# Altium schematic sheet fpga ram V1.SchDoc
size A3; Organization: Blinkinlabs, LLC
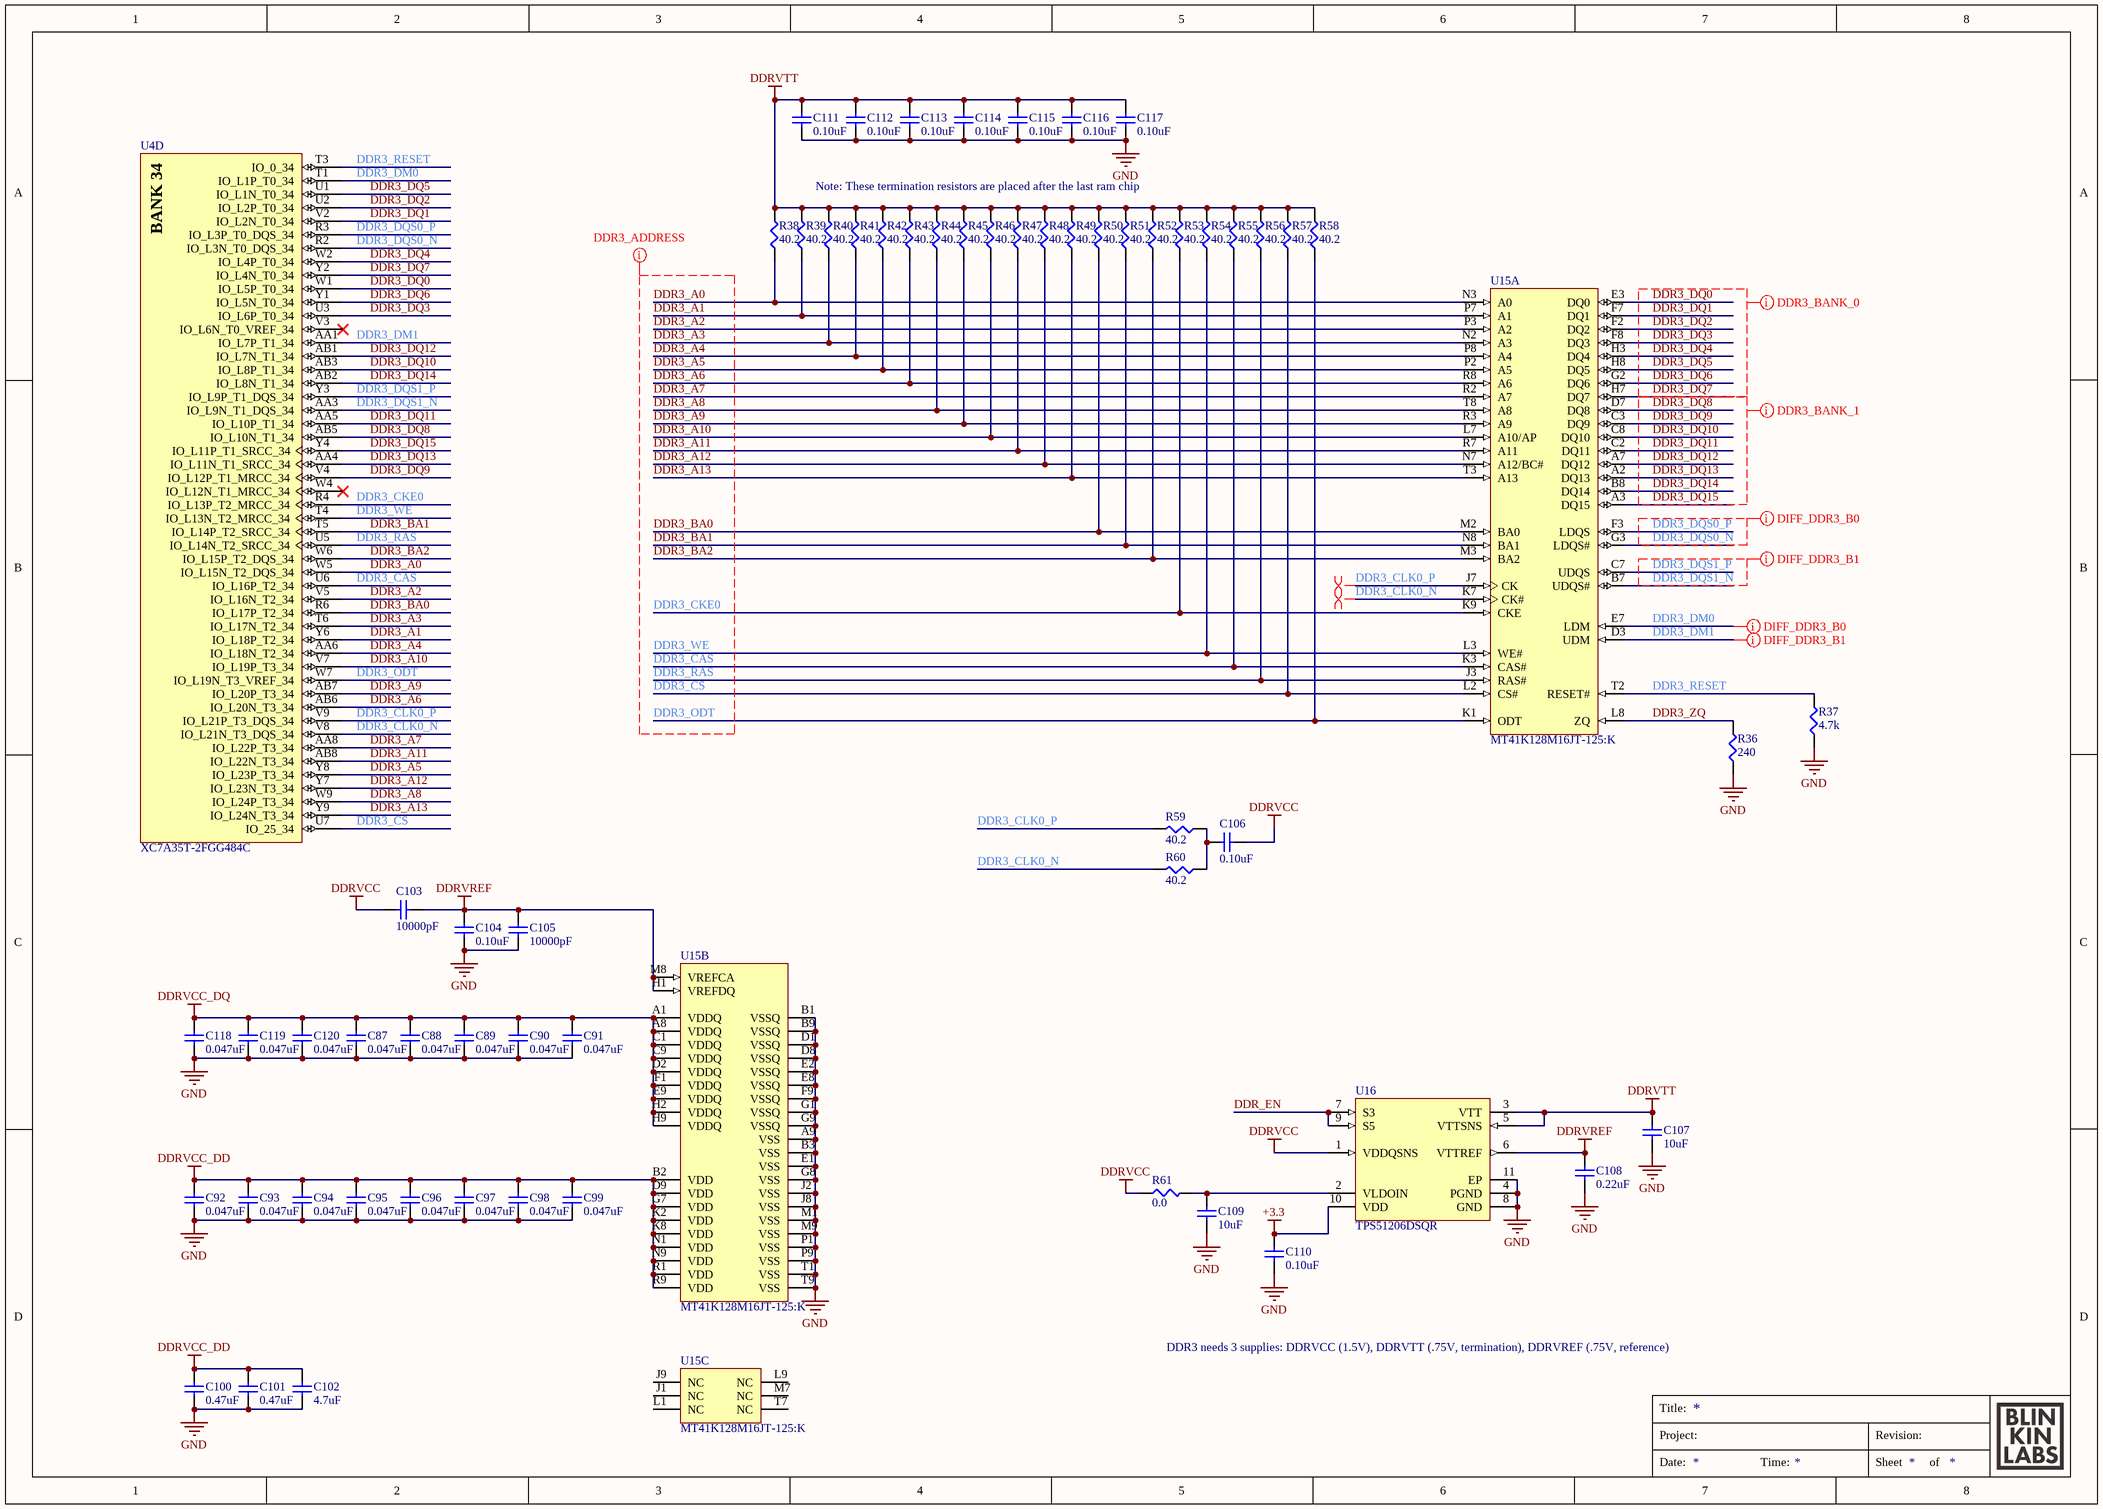
[diagram p0: fpga ram V1.SchDoc]

## Parts
C87  0.047uF  [CAPC1005X06L]
C88  0.047uF  [CAPC1005X06L]
C89  0.047uF  [CAPC1005X06L]
C90  0.047uF  [CAPC1005X06L]
C91  0.047uF  [CAPC1005X06L]
C92  0.047uF  [CAPC1005X06L]
C93  0.047uF  [CAPC1005X06L]
C94  0.047uF  [CAPC1005X06L]
C95  0.047uF  [CAPC1005X06L]
C96  0.047uF  [CAPC1005X06L]
C97  0.047uF  [CAPC1005X06L]
C98  0.047uF  [CAPC1005X06L]
C99  0.047uF  [CAPC1005X06L]
C100  0.47uF  [CAPC1005X06L]
C101  0.47uF  [CAPC1005X06L]
C102  4.7uF  [CAPC1005X06L]
C103  10000pF  [CAPC1005X06L]
C104  0.10uF  [CAPC1005X06L]
C105  10000pF  [CAPC1005X06L]
C106  0.10uF  [CAPC1005X06L]
C107  10uF  [CAPC1608X09L]
C108  0.22uF  [CAPC1005X06L]
C109  10uF  [CAPC1608X09L]
C110  0.10uF  [CAPC1005X06L]
C111  0.10uF  [CAPC1005X06L]
C112  0.10uF  [CAPC1005X06L]
C113  0.10uF  [CAPC1005X06L]
C114  0.10uF  [CAPC1005X06L]
C115  0.10uF  [CAPC1005X06L]
C116  0.10uF  [CAPC1005X06L]
C117  0.10uF  [CAPC1005X06L]
C118  0.047uF  [CAPC1005X06L]
C119  0.047uF  [CAPC1005X06L]
C120  0.047uF  [CAPC1005X06L]
R36  240  [ERJ2G(0402)_L]
R37  4.7k  [ERJ2G(0402)_L]
R38  40.2  [ERJ2G(0402)_L]
R39  40.2  [ERJ2G(0402)_L]
R40  40.2  [ERJ2G(0402)_L]
R41  40.2  [ERJ2G(0402)_L]
R42  40.2  [ERJ2G(0402)_L]
R43  40.2  [ERJ2G(0402)_L]
R44  40.2  [ERJ2G(0402)_L]
R45  40.2  [ERJ2G(0402)_L]
R46  40.2  [ERJ2G(0402)_L]
R47  40.2  [ERJ2G(0402)_L]
R48  40.2  [ERJ2G(0402)_L]
R49  40.2  [ERJ2G(0402)_L]
R50  40.2  [ERJ2G(0402)_L]
R51  40.2  [ERJ2G(0402)_L]
R52  40.2  [ERJ2G(0402)_L]
R53  40.2  [ERJ2G(0402)_L]
R54  40.2  [ERJ2G(0402)_L]
R55  40.2  [ERJ2G(0402)_L]
R56  40.2  [ERJ2G(0402)_L]
R57  40.2  [ERJ2G(0402)_L]
R58  40.2  [ERJ2G(0402)_L]
R59  40.2  [ERJ2G(0402)_L]
R60  40.2  [ERJ2G(0402)_L]
R61  0.0  [ERJ3G(0603)_L]
U4  XC7A35T-2FGG484C  [FGG484]  (part D of 12)
U15  MT41K128M16JT-125:K  [MICT-JT-96]  (parts A,B,C of 3)
U16  TPS51206DSQR  [DSQ0010A_V]

## Nets
+3.3: C110.1 U16.10(VDD)
DDRVCC: C103.1 C106.1 R61.1 U16.1(VDDQSNS)
DDRVCC_DD: C92.1 C93.1 C94.1 C95.1 C96.1 C97.1 C98.1 C99.1 C100.1 C101.1 C102.2 U15.B2(VDD) U15.D9(VDD) U15.G7(VDD) U15.K2(VDD) U15.K8(VDD) U15.N1(VDD) U15.N9(VDD) U15.R1(VDD) U15.R9(VDD)
DDRVCC_DQ: C87.1 C88.1 C89.1 C90.1 C91.1 C118.1 C119.1 C120.1 U15.A1(VDDQ) U15.A8(VDDQ) U15.C1(VDDQ) U15.C9(VDDQ) U15.D2(VDDQ) U15.E9(VDDQ) U15.F1(VDDQ) U15.H2(VDDQ) U15.H9(VDDQ)
DDRVREF: C103.2 C104.2 C105.1 C108.1 U15.H1(VREFDQ) U15.M8(VREFCA) U16.6(VTTREF)
DDRVTT: C107.1 C111.2 C112.2 C113.2 C114.2 C115.2 C116.2 C117.2 R38.2 R39.2 R40.2 R41.2 R42.2 R43.2 R44.2 R45.2 R46.2 R47.2 R48.2 R49.2 R50.2 R51.2 R52.2 R53.2 R54.2 R55.2 R56.2 R57.2 R58.2 U16.3(VTT) U16.5(VTTSNS)
GND: C87.2 C88.2 C89.2 C90.2 C91.2 C92.2 C93.2 C94.2 C95.2 C96.2 C97.2 C98.2 C99.2 C100.2 C101.2 C102.1 C104.1 C105.2 C107.2 C108.2 C109.2 C110.2 C111.1 C112.1 C113.1 C114.1 C115.1 C116.1 C117.1 C118.2 C119.2 C120.2 R36.1 R37.1 U15.A9(VSS) U15.B1(VSSQ) U15.B3(VSS) U15.B9(VSSQ) U15.D1(VSSQ) U15.D8(VSSQ) U15.E1(VSS) U15.E2(VSSQ) U15.E8(VSSQ) U15.F9(VSSQ) U15.G1(VSSQ) U15.G8(VSS) U15.G9(VSSQ) U15.J2(VSS) U15.J8(VSS) U15.M1(VSS) U15.M9(VSS) U15.P1(VSS) U15.P9(VSS) U15.T1(VSS) U15.T9(VSS) U16.4(PGND) U16.8(GND) U16.11(EP)
DDR3_A0: R38.1 U4.W5(IO_L15N_T2_DQS_34) U15.N3(A0)
DDR3_A1: R39.1 U4.Y6(IO_L18P_T2_34) U15.P7(A1)
DDR3_A2: U4.V5(IO_L16N_T2_34) U15.P3(A2)
DDR3_A3: R40.1 U4.T6(IO_L17N_T2_34) U15.N2(A3)
DDR3_A4: R41.1 U4.AA6(IO_L18N_T2_34) U15.P8(A4)
DDR3_A5: R42.1 U4.Y8(IO_L23P_T3_34) U15.P2(A5)
DDR3_A6: R43.1 U4.AB6(IO_L20N_T3_34) U15.R8(A6)
DDR3_A7: U4.AA8(IO_L22P_T3_34) U15.R2(A7)
DDR3_A8: R44.1 U4.W9(IO_L24P_T3_34) U15.T8(A8)
DDR3_A9: R45.1 U4.AB7(IO_L20P_T3_34) U15.R3(A9)
DDR3_A10: R46.1 U4.V7(IO_L19P_T3_34) U15.L7(A10/AP)
DDR3_A11: R47.1 U4.AB8(IO_L22N_T3_34) U15.R7(A11)
DDR3_A12: R48.1 U4.Y7(IO_L23N_T3_34) U15.N7(A12/BC#)
DDR3_A13: R49.1 U4.Y9(IO_L24N_T3_34) U15.T3(A13)
DDR3_BA0: R50.1 U4.R6(IO_L17P_T2_34) U15.M2(BA0)
DDR3_BA1: R51.1 U4.T5(IO_L14P_T2_SRCC_34) U15.N8(BA1)
DDR3_BA2: R52.1 U4.W6(IO_L15P_T2_DQS_34) U15.M3(BA2)
DDR3_CAS: R55.1 U4.U6(IO_L16P_T2_34) U15.K3(CAS#)
DDR3_CKE0: R53.1 U4.R4(IO_L13P_T2_MRCC_34) U15.K9(CKE)
DDR3_CLK0_N: R60.2 U4.V8(IO_L21N_T3_DQS_34) U15.K7(CK#)
DDR3_CLK0_P: R59.2 U4.V9(IO_L21P_T3_DQS_34) U15.J7(CK)
DDR3_CS: R57.1 U4.U7(IO_25_34) U15.L2(CS#)
DDR3_DM0: U4.T1(IO_L1P_T0_34) U15.E7(LDM)
DDR3_DM1: U4.AA1(IO_L7P_T1_34) U15.D3(UDM)
DDR3_DQ0: U4.W1(IO_L5P_T0_34) U15.E3(DQ0)
DDR3_DQ1: U4.V2(IO_L2N_T0_34) U15.F7(DQ1)
DDR3_DQ2: U4.U2(IO_L2P_T0_34) U15.F2(DQ2)
DDR3_DQ3: U4.U3(IO_L6P_T0_34) U15.F8(DQ3)
DDR3_DQ4: U4.W2(IO_L4P_T0_34) U15.H3(DQ4)
DDR3_DQ5: U4.U1(IO_L1N_T0_34) U15.H8(DQ5)
DDR3_DQ6: U4.Y1(IO_L5N_T0_34) U15.G2(DQ6)
DDR3_DQ7: U4.Y2(IO_L4N_T0_34) U15.H7(DQ7)
DDR3_DQ8: U4.AB5(IO_L10N_T1_34) U15.D7(DQ8)
DDR3_DQ9: U4.V4(IO_L12P_T1_MRCC_34) U15.C3(DQ9)
DDR3_DQ10: U4.AB3(IO_L8P_T1_34) U15.C8(DQ10)
DDR3_DQ11: U4.AA5(IO_L10P_T1_34) U15.C2(DQ11)
DDR3_DQ12: U4.AB1(IO_L7N_T1_34) U15.A7(DQ12)
DDR3_DQ13: U4.AA4(IO_L11N_T1_SRCC_34) U15.A2(DQ13)
DDR3_DQ14: U4.AB2(IO_L8N_T1_34) U15.B8(DQ14)
DDR3_DQ15: U4.Y4(IO_L11P_T1_SRCC_34) U15.A3(DQ15)
DDR3_DQS0_N: U4.R2(IO_L3N_T0_DQS_34) U15.G3(LDQS#)
DDR3_DQS0_P: U4.R3(IO_L3P_T0_DQS_34) U15.F3(LDQS)
DDR3_DQS1_N: U4.AA3(IO_L9N_T1_DQS_34) U15.B7(UDQS#)
DDR3_DQS1_P: U4.Y3(IO_L9P_T1_DQS_34) U15.C7(UDQS)
DDR3_ODT: R58.1 U4.W7(IO_L19N_T3_VREF_34) U15.K1(ODT)
DDR3_RAS: R56.1 U4.U5(IO_L14N_T2_SRCC_34) U15.J3(RAS#)
DDR3_RESET: R37.2 U4.T3(IO_0_34) U15.T2(RESET#)
DDR3_WE: R54.1 U4.T4(IO_L13N_T2_MRCC_34) U15.L3(WE#)
DDR3_ZQ: R36.2 U15.L8(ZQ)
DDR_EN: U16.7(S3) U16.9(S5)
NetC106_2: C106.2 R59.1 R60.1
NetC109_1: C109.1 R61.2 U16.2(VLDOIN)

Not connected (* = marked no-connect by the designer): U4 V3(IO_L6N_T0_VREF_34)* W4(IO_L12N_T1_MRCC_34)*; U15 J1(NC) J9(NC) L1(NC) L9(NC) M7(NC) T7(NC)

## Layout directives
net class DDR3_ADDRESS; net class DDR3_SE: DDR3_A0, DDR3_A1, DDR3_A2, DDR3_A3, DDR3_A4, DDR3_A5, DDR3_A6, DDR3_A7, DDR3_A8, DDR3_A9, DDR3_A10, DDR3_A11, DDR3_A12, DDR3_A13, DDR3_BA0, DDR3_BA1, DDR3_BA2, DDR3_CAS, DDR3_CKE0, DDR3_CS, DDR3_ODT, DDR3_RAS, DDR3_WE
net class DDR3_B0; rule Matched Net Lengths [Delay Tolerance = 15ps]; rule Impedance Constraint [Min = 50.00    Max = 50.00    ]; net class DDR3_SE: DDR3_DQ0, DDR3_DQ1, DDR3_DQ2, DDR3_DQ3, DDR3_DQ4, DDR3_DQ5, DDR3_DQ6, DDR3_DQ7
differential pair: DDR3_CLK0_N, DDR3_CLK0_P
net class DDR3_B1; rule Matched Net Lengths [Delay Tolerance = 15ps]; rule Impedance Constraint [Min = 50.00    Max = 50.00    ]; net class DDR3_SE: DDR3_DQ7, DDR3_DQ8, DDR3_DQ9, DDR3_DQ10, DDR3_DQ11, DDR3_DQ12, DDR3_DQ13, DDR3_DQ14, DDR3_DQ15
differential pair; differential pair class DIFF_90Ohm_PCIE; differential pair class DIFF_DDR3_B0; net class DDR3; rule Matched Net Lengths [Tolerance = 0.1mm]: DDR3_DM0, DDR3_DQS0_N, DDR3_DQS0_P
differential pair; differential pair class DIFF_90Ohm_PCIE; differential pair class DIFF_DDR3_B1; net class DDR3; rule Matched Net Lengths [Tolerance = 0.1mm]: DDR3_DM1, DDR3_DQS1_N, DDR3_DQS1_P

## Notes on the sheet
- Note: These termination resistors are placed after the last ram chip
- DDR3 needs 3 supplies: DDRVCC (1.5V), DDRVTT (.75V, termination), DDRVREF (.75V, reference)
- Title:
- Project:
- Revision:
- Date:
- Time:
- Sheet
- of
- (in symbol CMP-0383-00019-1, part D) BANK 34

## Library data of the parts
C87-C99 C118-C120 = GRM155R60J473KA01D: CAP CER 0.047UF 6.3V X5R 0402; Manufacturer: Murata Electronics North America; Tolerance: ±10%; PartNumber: GRM155R60J473KA01D; Datasheets: http://www.murata.com/~/media/webrenewal/support/library/catalog/products/capacitor/mlcc/c02e.pdf; Image: //media.digikey.com/Renders/Murata%20Renders/ZRB-SERIES-0402.jpg; Digi-Key Part Number: 490-8250-1-ND; Packaging: Cut Tape (CT); Series: GRM; Value: 0.047uF; Voltage: 6.3V; Temperature Coefficient: X5R; Operating Temperature: -55°C ~ 85°C; Features: -; Applications: General Purpose; Package / Case: 0402 (1005 Metric); Case/Package: 0402
C100 C101 = GRM155R60J474KE19D: CAP CER 0.47UF 6.3V X5R 0402; Manufacturer: Murata Electronics North America; Tolerance: ±10%; PartNumber: GRM155R60J474KE19D; Datasheets: http://www.murata.com/~/media/webrenewal/support/library/catalog/products/capacitor/mlcc/c02e.pdf; Image: //media.digikey.com/Renders/Murata%20Renders/ZRB-SERIES-0402.jpg; Digi-Key Part Number: 490-3266-1-ND; Packaging: Cut Tape (CT); Series: GRM; Value: 0.47uF; Voltage: 6.3V; Temperature Coefficient: X5R; Operating Temperature: -55°C ~ 85°C; Features: -; Applications: General Purpose; Package / Case: 0402 (1005 Metric); Case/Package: 0402
C102 = GRM155R60G475ME47D: CAP CER 4.7UF 4V X5R 0402; Manufacturer: Murata Electronics North America; Tolerance: ±20%; PartNumber: GRM155R60G475ME47D; Datasheets: http://www.murata.com/~/media/webrenewal/support/library/catalog/products/capacitor/mlcc/c02e.pdf; Image: //media.digikey.com/Renders/Murata%20Renders/ZRB-SERIES-0402.jpg; Digi-Key Part Number: 490-11980-1-ND; Packaging: Cut Tape (CT); Series: GRM; Value: 4.7uF; Voltage: 4V; Temperature Coefficient: X5R; Operating Temperature: -55°C ~ 85°C; Features: -; Applications: General Purpose; Package / Case: 0402 (1005 Metric); Case/Package: 0402
C103 C105 = GRM155R71C103KA01D: CAP CER 10000PF 16V X7R 0402; Manufacturer: Murata Electronics North America; Tolerance: ±10%; PartNumber: GRM155R71C103KA01D; Datasheets: http://www.murata.com/~/media/webrenewal/support/library/catalog/products/capacitor/mlcc/c02e.pdf; Image: //media.digikey.com/Renders/Murata%20Renders/ZRB-SERIES-0402.jpg; Digi-Key Part Number: 490-1313-1-ND; Packaging: Cut Tape (CT); Series: GRM; Value: 10000pF; Voltage: 16V; Temperature Coefficient: X7R; Operating Temperature: -55°C ~ 125°C; Features: -; Applications: General Purpose; Package / Case: 0402 (1005 Metric); Case/Package: 0402
C104 C106 C110-C117 = GRM155R61A104KA01D: CAP CER 0.1UF 10V X5R 0402; Manufacturer: Murata Electronics North America; Tolerance: ±10%; PartNumber: GRM155R61A104KA01D; Datasheets: http://www.murata.com/~/media/webrenewal/support/library/catalog/products/capacitor/mlcc/c02e.pdf; Image: //media.digikey.com/Renders/Murata%20Renders/ZRB-SERIES-0402.jpg; Digi-Key Part Number: 490-1318-1-ND; Packaging: Cut Tape (CT); Series: GRM; Value: 0.10uF; Voltage: 10V; Temperature Coefficient: X5R; Operating Temperature: -55°C ~ 85°C; Features: -; Applications: General Purpose; Package / Case: 0402 (1005 Metric); Case/Package: 0402
C107 C109 = GRM188R60J106ME47D: CAP CER 10UF 6.3V X5R 0603; Manufacturer: Murata Electronics North America; Tolerance: ±20%; PartNumber: GRM188R60J106ME47D; Datasheets: http://www.murata.com/~/media/webrenewal/support/library/catalog/products/capacitor/mlcc/c02e.pdf; Image: //media.digikey.com/Renders/Murata%20Renders/ZRB-SERIES-0402.jpg; Digi-Key Part Number: 490-3896-1-ND; Series: GRM; Value: 10uF; Voltage: 6.3V; Temperature Coefficient: X5R; Operating Temperature: -55°C ~ 85°C; Features: -; Applications: General Purpose; Package / Case: 0603 (1608 Metric); Case/Package: 0603
C108 = GRM155R61A224KE19J: CAP CER 0.22UF 10V X5R 0402; Manufacturer: Murata Electronics North America; Tolerance: ±10%; PartNumber: GRM155R61A224KE19J; Datasheets: http://www.murata.com/~/media/webrenewal/support/library/catalog/products/capacitor/mlcc/c02e.pdf; Image: //media.digikey.com/Renders/Murata%20Renders/ZRB-SERIES-0402.jpg; Digi-Key Part Number: 490-6303-1-ND; Packaging: Cut Tape (CT); Series: GRM; Value: 0.22uF; Voltage: 10V; Temperature Coefficient: X5R; Operating Temperature: -55°C ~ 85°C; Features: -; Applications: General Purpose; Package / Case: 0402 (1005 Metric); Case/Package: 0402
R36 = ERJ-2RKF2400X: RES SMD 240 OHM 1% 1/10W 0402; Manufacturer: Panasonic Electronic Components; Power (Watts): 0.1W, 1/10W; Temperature Coefficient: ±100ppm/°C; PartNumber: ERJ-2RKF2400X; Datasheets: http://industrial.panasonic.com/www-cgi/jvcr13pz.cgi?E+PZ+3+AOA0002+ERJ2RKF2400X+7+WW; Image: //media.digikey.com/Photos/Panasonic%20Photos/ERJ-PA2-Series.jpg; Digi-Key Part Number: P240LCT-ND; Series: ERJ; Value: 240; Tolerance: ±1%; Composition: Thick Film; Features: Automotive AEC-Q200; Operating Temperature: -55°C ~ 155°C; Package / Case: 0402 (1005 Metric); Case/Package: 0402; Size / Dimension: 0.039" L x 0.020" W (1.00mm x 0.50mm); Height - Seated (Max): 0.016" (0.40mm); Number of Terminations: 2
R37 = ERJ-PA2F4701X: RES SMD 4.7K OHM 1% 1/5W 0402; Manufacturer: Panasonic Electronic Components; Power (Watts): 0.2W, 1/5W; Temperature Coefficient: ±100ppm/°C; PartNumber: ERJ-PA2F4701X; Datasheets: https://industrial.panasonic.com/cdbs/www-data/pdf/RDA0000/AOA0000C243.pdf; Image: //media.digikey.com/Photos/Panasonic%20Photos/ERJ-PA2-Series.jpg; Digi-Key Part Number: P17228CT-ND; Series: ERJ; Value: 4.7k; Tolerance: ±1%; Composition: Thick Film; Features: Automotive AEC-Q200, Pulse Withstanding; Operating Temperature: -55°C ~ 155°C; Package / Case: 0402 (1005 Metric); Case/Package: 0402; Size / Dimension: 0.039" L x 0.020" W (1.00mm x 0.50mm); Height - Seated (Max): 0.016" (0.40mm); Number of Terminations: 2
R38-R60 = ERJ-2RKF40R2X: RES SMD 40.2 OHM 1% 1/10W 0402; Manufacturer: Panasonic Electronic Components; Power (Watts): 0.1W, 1/10W; Temperature Coefficient: ±100ppm/°C; PartNumber: ERJ-2RKF40R2X; Datasheets: http://industrial.panasonic.com/www-cgi/jvcr13pz.cgi?E+PZ+3+AOA0002+ERJ2RKF40R2X+7+WW; Image: //media.digikey.com/Photos/Panasonic%20Photos/ERJ-PA2-Series.jpg; Digi-Key Part Number: P40.2LCT-ND; Series: ERJ; Value: 40.2; Tolerance: ±1%; Composition: Thick Film; Features: Automotive AEC-Q200; Operating Temperature: -55°C ~ 155°C; Package / Case: 0402 (1005 Metric); Case/Package: 0402; Size / Dimension: 0.039" L x 0.020" W (1.00mm x 0.50mm); Height - Seated (Max): 0.016" (0.40mm); Number of Terminations: 2
R61 = ERJ-3GEY0R00V: RES SMD 0.0OHM JUMPER 1/10W 0603; Manufacturer: Panasonic Electronic Components; Power (Watts): 0.1W, 1/10W; PartNumber: ERJ-3GEY0R00V; Datasheets: http://industrial.panasonic.com/www-cgi/jvcr13pz.cgi?E+PZ+3+AOA0001+ERJ3GEY0R00V+7+WW; Image: //media.digikey.com/Photos/Panasonic%20Photos/MFG_ERJ-P6W%20Series.jpg; Digi-Key Part Number: P0.0GCT-ND; Series: ERJ; Value: 0.0; Tolerance: Jumper; Composition: Thick Film; Features: Automotive AEC-Q200; Temperature Coefficient: -; Operating Temperature: -55°C ~ 155°C; Package / Case: 0603 (1608 Metric); Case/Package: 0603; Size / Dimension: 0.063" L x 0.031" W (1.60mm x 0.80mm); Height - Seated (Max): 0.022" (0.55mm); Number of Terminations: 2
U4 = CMP-0383-00019-1: Artix-7 FPGA, 250 User I/Os, 4 GTP, 484-Ball BGA, Speed Grade 2, Commercial Grade, Pb-Free; Manufacturer: Xilinx; Total Block RAM: 1800 Kb; GTP: 4; Available User I/O: 250; Speed Grades: 2; Logic Cells: 33280; CMTs: 5; ComponentLink3URL: http://www.xilinx.com/support/documentation/user_guides/ug475_7Series_Pkg_Pinout.pdf; PackageVersion: Rev. 1.11; ComponentLink2Description: Datasheet; ComponentLink3Description: Pinout; PartNumber: XC7A35T-2FGG484C; DatasheetVersion: Rev. 1.15; Operating Temperature Range: Commercial; PackageDescription: 484-Ball Wire-Bond Fine-Pitch BGA, Body 23 x 23 mm, Pitch 1 mm; ComponentLink4Description: Package Specification; Maximum Distributed RAM: 400 Kb; Mounting Technology: Surface Mount; ComponentLink2URL: http://www.xilinx.com/support/documentation/data_sheets/ds180_7Series_Overview.pdf; ComponentLink1Description: Manufacturer URL; ComponentLink4URL: http://www.xilinx.com/support/documentation/user_guides/ug475_7Series_Pkg_Pinout.pdf; PackageReference: FGG484; ComponentLink1URL: http://www.xilinx.com/
U15 = CMP-2000-04975-1: 2Gb DDR3-1600 SDRAM, 128Mb x 16, 1.25 ns, 1.35 V, 0 to 95 degC, 96-Ball FBGA; Manufacturer: Micron; Density: 2147483648Bit; Organization: 128Mx16; Supply Current: 138mA; Maximum Clock Rate: 1600MHz; Operating Supply Voltage (Min): 1.283V; Address Bus: 17b; Operating Supply Voltage (Typ): 1.35V; Operating Supply Voltage (Max): 1.45V; Rad Hardened: No; Manufacturer URL: https://www.micron.com/; Type: DDR3LSDRAM; Package Description: 96-Ball Ball Grid Array, Body 14 x 8 mm, Pitch 0.8 mm; Operating Temp Range: 0Cto95C; Pin Count: 96; Package Reference: JT-96; Operating Temperature Classification: Commercial; Mounting: SurfaceMount; Datasheet URL: http://download.siliconexpert.com/pdfs/2013/11/24/21/35/34/146/mic_/manual/272gb_1_35v_ddr3l.pdf; Datasheet Version: Rev. K , 09/2013; Package Type: FBGA
U16 = CMP-0395-00678-2: Single Output LDO, 2 A, with VTTREF Buffered Reference for DDR2, DDR3, DDR3L, 10-pin SON (DSQ), -40 to 85 degC, Green (RoHS & no Sb/Br); Manufacturer: Texas Instruments; SubFamily: Single Channel LDO; Iout(Max)(A): 2; Rating: Catalog; ComponentLink2Description: Datasheet; ComponentLink1URL: http://www.ti.com/; ComponentLink4URL: Samples URL:http://www.ti.com/product/tps51206#samples; PackageVersion: 4209243/B; Mounting Technology: Surface Mount; PackageReference: DSQ0010A; Eco-Plan: Green (RoHS & no Sb/Br); PackageDescription: 10-Pin Plastic Small Outline, Body 2 X 2 mm, Pitch 0.4 mm; ComponentLink4Description: URL Link1; DatasheetVersion: SLUSAH1; ComponentLink3URL: http://www.ti.com/litv/pdf/mpdi002c; ComponentLink2URL: http://www.ti.com/general/docs/lit/getliterature.tsp?genericPartNumber=TPS51206&fileType=pdf; PartNumber: TPS51206DSQR; ComponentLink3Description: Package Specification; ComponentLink1Description: Manufacturer URL